# Altium schematic sheet module.SchDoc: NVM connections
size A3; Organization: GPA Robotics; DocumentNumber: 3; Revision: REV 0; SheetNumber: 3; SheetTotal: 11
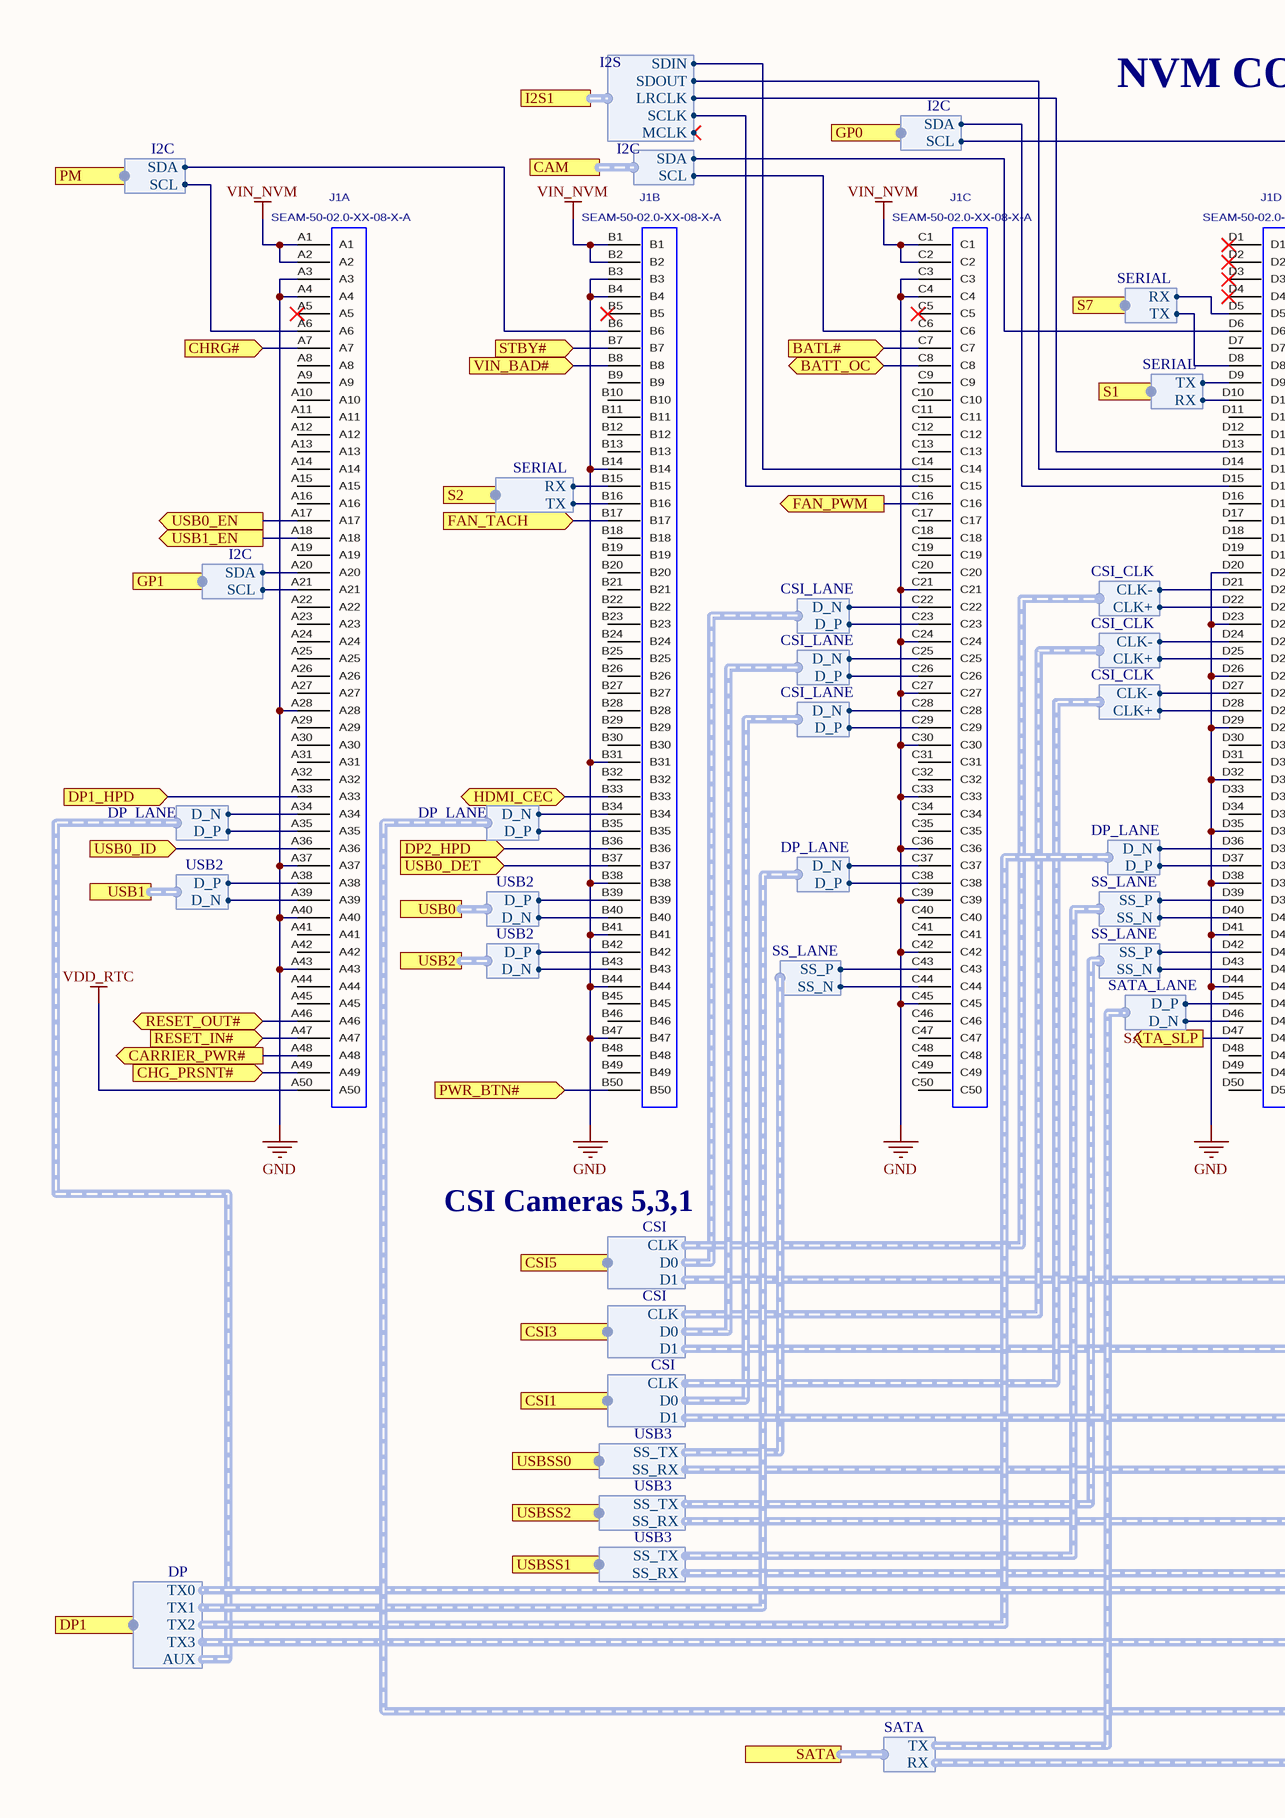
[diagram p0: module.SchDoc, left]
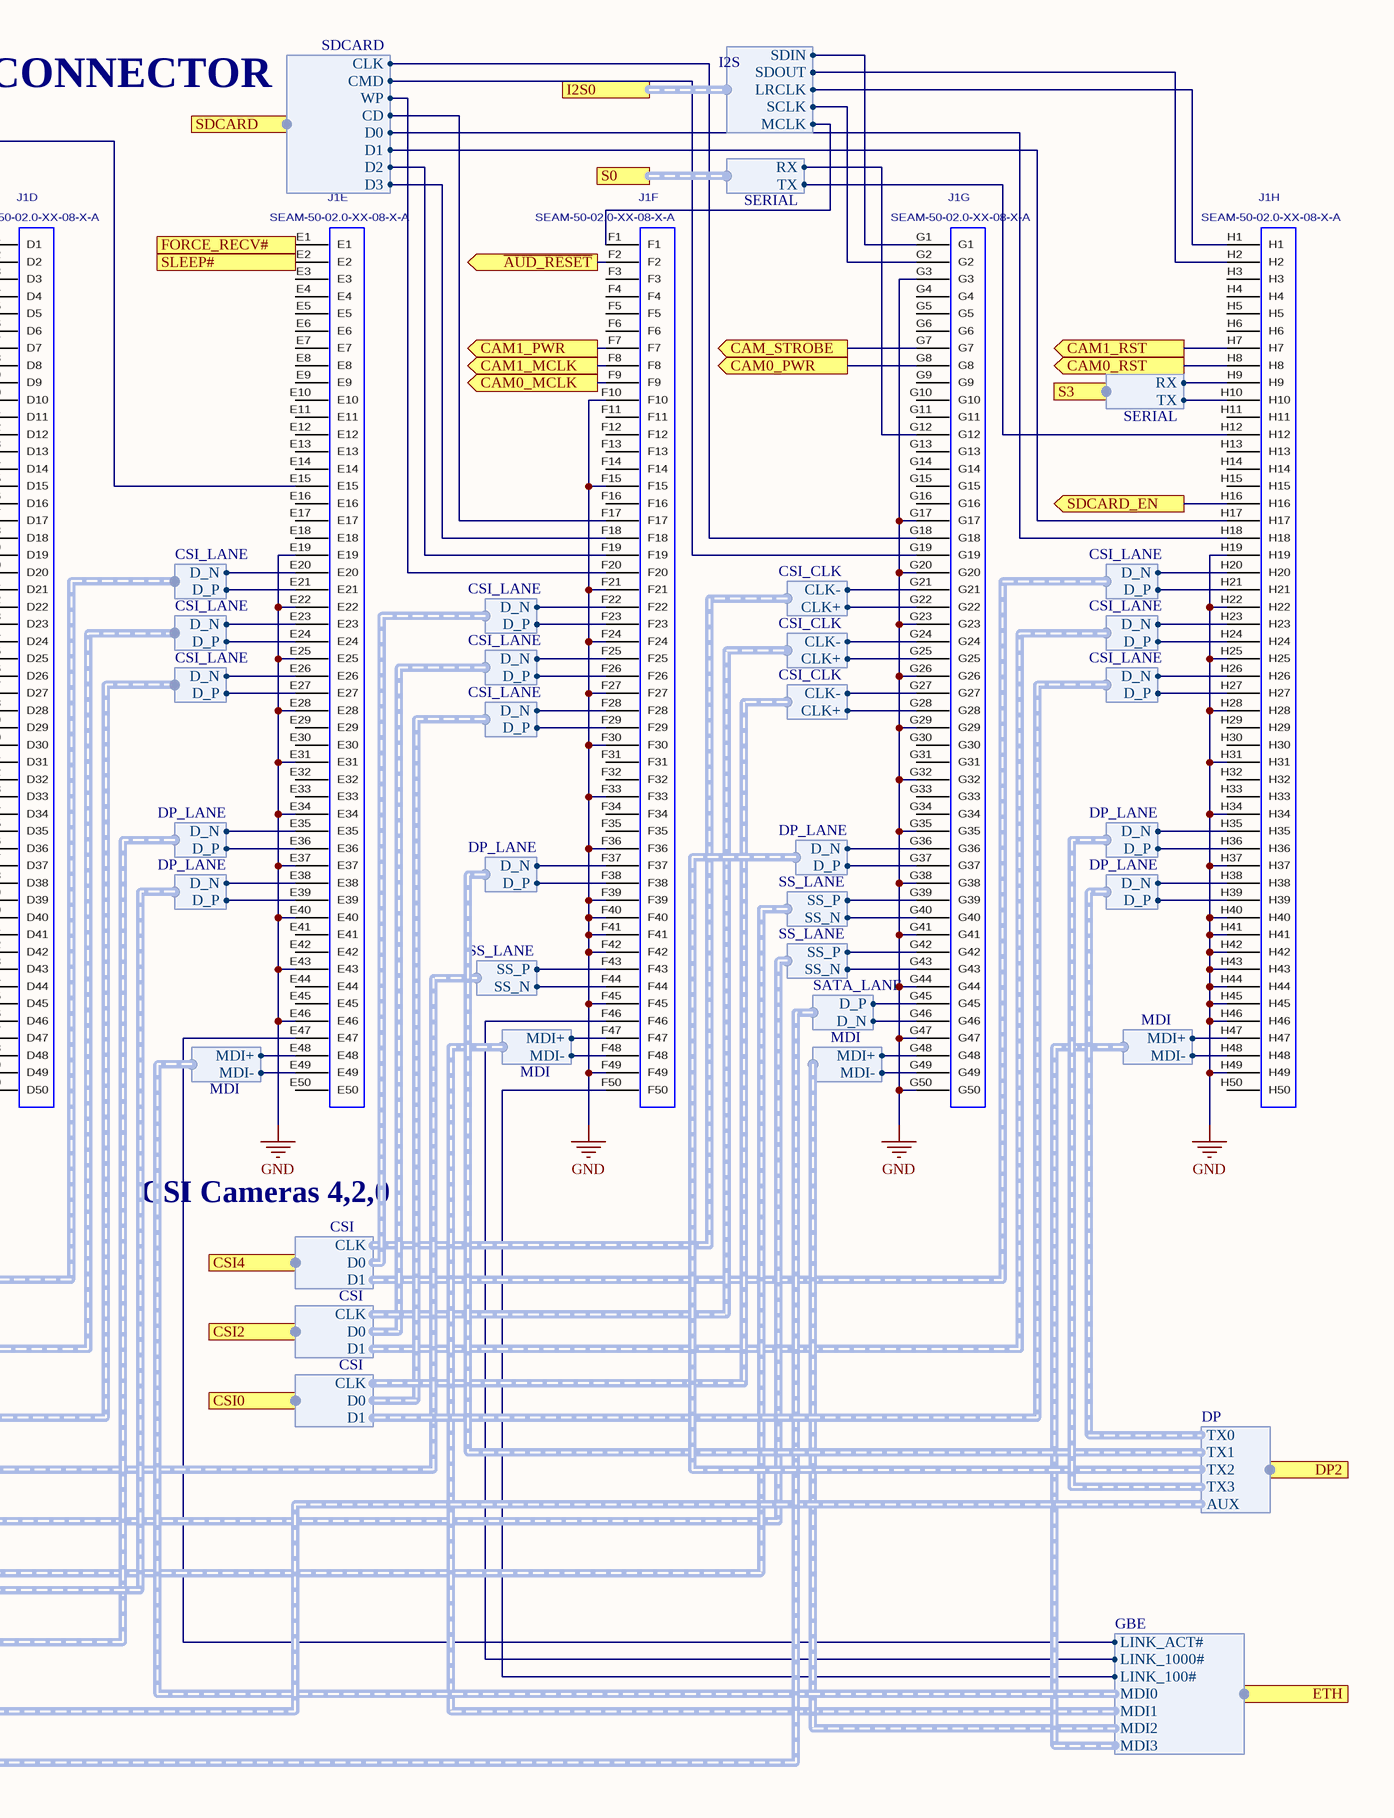
[diagram p1: module.SchDoc, right]

## Parts
J1  SEAM-50-02.0-XX-08-X-A  [SEAM-50-02.0-XX-08-X-A]  (parts A,B,C,D,E,F,G,H of 8)

## Ports
BATL# (in), BATT_OC (bidir), CAM0_MCLK (out), CAM0_PWR (out), CAM0_RST (out), CAM1_MCLK (out), CAM1_PWR (out), CAM1_RST (out), CAM (harness I2C), CAM_STROBE (out), CARRIER_PWR# (out), CHG_PRSNT# (in), CHRG# (in), CSI0 (harness CSI), CSI1 (harness CSI), CSI2 (harness CSI), CSI3 (harness CSI), CSI4 (harness CSI), CSI5 (harness CSI), DP1 (harness DP), DP1_HPD (in), DP2 (harness DP), DP2_HPD (in), ETH (harness GBE), FAN_PWM (out), FAN_TACH (in), FORCE_RECV# (in), GP0 (harness I2C), GP1 (harness I2C), HDMI_CEC (bidir), I2S0 (harness I2S), I2S1 (harness I2S), PM (harness I2C), PWR_BTN# (in), RESET_IN# (in), RESET_OUT# (bidir), S0 (harness SERIAL), S1 (harness SERIAL), S2 (harness SERIAL), S3 (harness SERIAL), S7 (harness SERIAL), SATA (harness SATA), SATA_SLP (out), SDCARD (harness SDCARD), SDCARD_EN (out), SLEEP# (in), STBY# (in), USB0 (harness USB2), USB0_DET (in), USB0_EN (out), USB0_ID (in), USB1 (harness USB2), USB1_EN (out), USB2 (harness USB2), USBSS0 (harness USB3), USBSS1 (harness USB3), USBSS2 (harness USB3), VIN_BAD# (in), ~{AUD_RESET} (out)

## Harnesses
CSI_CLK: CLK+, CLK-
CSI_LANE: D_P, D_N
CSI: D0, CLK, D1
USB3: SS_RX, SS_TX
USB2: D_P, D_N
I2C: SDA, SCL
SS_LANE: SS_P, SS_N
GBE: LINK_ACT#, LINK_1000#, LINK_100#, MDI0, MDI1, MDI2, MDI3
MDI: MDI+, MDI-
SDCARD: CLK, CMD, WP, CD, D0, D1, D2, D3
SERIAL: RX, TX
DP: TX1, TX0, TX2, TX3, AUX
DP_LANE: D_P, D_N
SATA: TX, RX
SATA_LANE: D_P, D_N
I2S: SDIN, SDOUT, LRCLK, SCLK, MCLK

## Nets
GND: J1.A3 J1.A4 J1.A28 J1.A37 J1.A40 J1.A43 J1.B3 J1.B4 J1.B14 J1.B31 J1.B38 J1.B41 J1.B44 J1.B47 J1.C3 J1.C4 J1.C21 J1.C24 J1.C27 J1.C30 J1.C33 J1.C36 J1.C39 J1.C42 J1.C45 J1.D20 J1.D23 J1.D26 J1.D29 J1.D32 J1.D35 J1.D38 J1.D41 J1.D44 J1.E19 J1.E22 J1.E25 J1.E28 J1.E31 J1.E34 J1.E37 J1.E40 J1.E43 J1.E46 J1.F10 J1.F15 J1.F21 J1.F24 J1.F27 J1.F30 J1.F33 J1.F36 J1.F39 J1.F40 J1.F41 J1.F42 J1.F45 J1.F49 J1.G3 J1.G17 J1.G20 J1.G23 J1.G26 J1.G29 J1.G32 J1.G35 J1.G38 J1.G41 J1.G44 J1.G47 J1.G50 J1.H19 J1.H22 J1.H25 J1.H28 J1.H31 J1.H34 J1.H37 J1.H40 J1.H41 J1.H42 J1.H43 J1.H44 J1.H45 J1.H46 J1.H49
VDD_RTC: J1.A50
VIN_NVM: J1.A1 J1.A2 J1.B1 J1.B2 J1.C1 J1.C2
~{AUD_RESET}: J1.F2 ; port ~{AUD_RESET}
BATL#: J1.C7 ; port BATL#
BATT_OC: J1.C8 ; port BATT_OC
CAM0_MCLK: J1.F9 ; port CAM0_MCLK
CAM0_PWR: J1.G8 ; port CAM0_PWR
CAM0_RST: J1.H8 ; port CAM0_RST
CAM1_MCLK: J1.F8 ; port CAM1_MCLK
CAM1_PWR: J1.F7 ; port CAM1_PWR
CAM1_RST: J1.H7 ; port CAM1_RST
CAM_STROBE: J1.G7 ; port CAM_STROBE
CARRIER_PWR#: J1.A48 ; port CARRIER_PWR#
CHG_PRSNT#: J1.A49 ; port CHG_PRSNT#
CHRG#: J1.A7 ; port CHRG#
DP1_HPD: J1.A33 ; port DP1_HPD
DP2_HPD: J1.B36 ; port DP2_HPD
FAN_PWM: J1.C16 ; port FAN_PWM
FAN_TACH: J1.B17 ; port FAN_TACH
FORCE_RECV#: J1.E1 ; port FORCE_RECV#
HDMI_CEC: J1.B33 ; port HDMI_CEC
PWR_BTN#: J1.B50 ; port PWR_BTN#
RESET_IN#: J1.A47 ; port RESET_IN#
RESET_OUT#: J1.A46 ; port RESET_OUT#
SATA_SLP: J1.D47 ; port SATA_SLP
SDCARD_EN: J1.H16 ; port SDCARD_EN
SLEEP#: J1.E2 ; port SLEEP#
STBY#: J1.B7 ; port STBY#
USB0_DET: J1.B37 ; port USB0_DET
USB0_EN: J1.A17 ; port USB0_EN
USB0_ID: J1.A36 ; port USB0_ID
USB1_EN: J1.A18 ; port USB1_EN
VIN_BAD#: J1.B8 ; port VIN_BAD#
NetJ1_A6: J1.A6 ; port PM.SCL
NetJ1_A20: J1.A20 ; port GP1.SDA
NetJ1_A21: J1.A21 ; port GP1.SCL
NetJ1_A34: J1.A34 ; harness DP_LANE.D_N
NetJ1_A35: J1.A35 ; harness DP_LANE.D_P
NetJ1_A38: J1.A38 ; port USB1.D_P
NetJ1_A39: J1.A39 ; port USB1.D_N
NetJ1_B6: J1.B6 ; port PM.SDA
NetJ1_B15: J1.B15 ; port S2.RX
NetJ1_B16: J1.B16 ; port S2.TX
NetJ1_B34: J1.B34 ; harness DP_LANE.D_N
NetJ1_B35: J1.B35 ; harness DP_LANE.D_P
NetJ1_B39: J1.B39 ; port USB0.D_P
NetJ1_B40: J1.B40 ; port USB0.D_N
NetJ1_B42: J1.B42 ; port USB2.D_P
NetJ1_B43: J1.B43 ; port USB2.D_N
NetJ1_C6: J1.C6 ; port CAM.SCL
NetJ1_C14: J1.C14 ; port I2S1.SDIN
NetJ1_C15: J1.C15 ; port I2S1.SCLK
NetJ1_C22: J1.C22 ; harness CSI_LANE.D_N
NetJ1_C23: J1.C23 ; harness CSI_LANE.D_P
NetJ1_C25: J1.C25 ; harness CSI_LANE.D_N
NetJ1_C26: J1.C26 ; harness CSI_LANE.D_P
NetJ1_C28: J1.C28 ; harness CSI_LANE.D_N
NetJ1_C29: J1.C29 ; harness CSI_LANE.D_P
NetJ1_C37: J1.C37 ; harness DP_LANE.D_N
NetJ1_C38: J1.C38 ; harness DP_LANE.D_P
NetJ1_C43: J1.C43 ; harness SS_LANE.SS_P
NetJ1_C44: J1.C44 ; harness SS_LANE.SS_N
NetJ1_D5: J1.D5 ; port S7.RX
NetJ1_D6: J1.D6 ; port CAM.SDA
NetJ1_D8: J1.D8 ; port S7.TX
NetJ1_D9: J1.D9 ; port S1.TX
NetJ1_D10: J1.D10 ; port S1.RX
NetJ1_D13: J1.D13 ; port I2S1.LRCLK
NetJ1_D14: J1.D14 ; port I2S1.SDOUT
NetJ1_D15: J1.D15 ; port GP0.SDA
NetJ1_D21: J1.D21 ; harness CSI_CLK.CLK-
NetJ1_D22: J1.D22 ; harness CSI_CLK.CLK+
NetJ1_D24: J1.D24 ; harness CSI_CLK.CLK-
NetJ1_D25: J1.D25 ; harness CSI_CLK.CLK+
NetJ1_D27: J1.D27 ; harness CSI_CLK.CLK-
NetJ1_D28: J1.D28 ; harness CSI_CLK.CLK+
NetJ1_D36: J1.D36 ; harness DP_LANE.D_N
NetJ1_D37: J1.D37 ; harness DP_LANE.D_P
NetJ1_D39: J1.D39 ; harness SS_LANE.SS_P
NetJ1_D40: J1.D40 ; harness SS_LANE.SS_N
NetJ1_D42: J1.D42 ; harness SS_LANE.SS_P
NetJ1_D43: J1.D43 ; harness SS_LANE.SS_N
NetJ1_D45: J1.D45 ; harness SATA_LANE.D_P
NetJ1_D46: J1.D46 ; harness SATA_LANE.D_N
NetJ1_E15: J1.E15 ; port GP0.SCL
NetJ1_E20: J1.E20 ; harness CSI_LANE.D_N
NetJ1_E21: J1.E21 ; harness CSI_LANE.D_P
NetJ1_E23: J1.E23 ; harness CSI_LANE.D_N
NetJ1_E24: J1.E24 ; harness CSI_LANE.D_P
NetJ1_E26: J1.E26 ; harness CSI_LANE.D_N
NetJ1_E27: J1.E27 ; harness CSI_LANE.D_P
NetJ1_E35: J1.E35 ; harness DP_LANE.D_N
NetJ1_E36: J1.E36 ; harness DP_LANE.D_P
NetJ1_E38: J1.E38 ; harness DP_LANE.D_N
NetJ1_E39: J1.E39 ; harness DP_LANE.D_P
NetJ1_E47: J1.E47 ; port ETH.LINK_ACT#
NetJ1_E48: J1.E48 ; harness MDI.MDI+
NetJ1_E49: J1.E49 ; harness MDI.MDI-
NetJ1_F1: J1.F1 ; port I2S0.MCLK
NetJ1_F17: J1.F17 ; port SDCARD.CD
NetJ1_F18: J1.F18 ; port SDCARD.D3
NetJ1_F19: J1.F19 ; port SDCARD.D2
NetJ1_F20: J1.F20 ; port SDCARD.WP
NetJ1_F22: J1.F22 ; harness CSI_LANE.D_N
NetJ1_F23: J1.F23 ; harness CSI_LANE.D_P
NetJ1_F25: J1.F25 ; harness CSI_LANE.D_N
NetJ1_F26: J1.F26 ; harness CSI_LANE.D_P
NetJ1_F28: J1.F28 ; harness CSI_LANE.D_N
NetJ1_F29: J1.F29 ; harness CSI_LANE.D_P
NetJ1_F37: J1.F37 ; harness DP_LANE.D_N
NetJ1_F38: J1.F38 ; harness DP_LANE.D_P
NetJ1_F43: J1.F43 ; harness SS_LANE.SS_P
NetJ1_F44: J1.F44 ; harness SS_LANE.SS_N
NetJ1_F46: J1.F46 ; port ETH.LINK_1000#
NetJ1_F47: J1.F47 ; harness MDI.MDI+
NetJ1_F48: J1.F48 ; harness MDI.MDI-
NetJ1_F50: J1.F50 ; port ETH.LINK_100#
NetJ1_G1: J1.G1 ; port I2S0.SDIN
NetJ1_G2: J1.G2 ; port I2S0.SCLK
NetJ1_G12: J1.G12 ; port S0.RX
NetJ1_G18: J1.G18 ; port SDCARD.CLK
NetJ1_G19: J1.G19 ; port SDCARD.CMD
NetJ1_G21: J1.G21 ; harness CSI_CLK.CLK-
NetJ1_G22: J1.G22 ; harness CSI_CLK.CLK+
NetJ1_G24: J1.G24 ; harness CSI_CLK.CLK-
NetJ1_G25: J1.G25 ; harness CSI_CLK.CLK+
NetJ1_G27: J1.G27 ; harness CSI_CLK.CLK-
NetJ1_G28: J1.G28 ; harness CSI_CLK.CLK+
NetJ1_G36: J1.G36 ; harness DP_LANE.D_N
NetJ1_G37: J1.G37 ; harness DP_LANE.D_P
NetJ1_G39: J1.G39 ; harness SS_LANE.SS_P
NetJ1_G40: J1.G40 ; harness SS_LANE.SS_N
NetJ1_G42: J1.G42 ; harness SS_LANE.SS_P
NetJ1_G43: J1.G43 ; harness SS_LANE.SS_N
NetJ1_G45: J1.G45 ; harness SATA_LANE.D_P
NetJ1_G46: J1.G46 ; harness SATA_LANE.D_N
NetJ1_G48: J1.G48 ; harness MDI.MDI+
NetJ1_G49: J1.G49 ; harness MDI.MDI-
NetJ1_H1: J1.H1 ; port I2S0.LRCLK
NetJ1_H2: J1.H2 ; port I2S0.SDOUT
NetJ1_H9: J1.H9 ; port S3.RX
NetJ1_H10: J1.H10 ; port S3.TX
NetJ1_H12: J1.H12 ; port S0.TX
NetJ1_H17: J1.H17 ; port SDCARD.D1
NetJ1_H18: J1.H18 ; port SDCARD.D0
NetJ1_H20: J1.H20 ; harness CSI_LANE.D_N
NetJ1_H21: J1.H21 ; harness CSI_LANE.D_P
NetJ1_H23: J1.H23 ; harness CSI_LANE.D_N
NetJ1_H24: J1.H24 ; harness CSI_LANE.D_P
NetJ1_H26: J1.H26 ; harness CSI_LANE.D_N
NetJ1_H27: J1.H27 ; harness CSI_LANE.D_P
NetJ1_H35: J1.H35 ; harness DP_LANE.D_N
NetJ1_H36: J1.H36 ; harness DP_LANE.D_P
NetJ1_H38: J1.H38 ; harness DP_LANE.D_N
NetJ1_H39: J1.H39 ; harness DP_LANE.D_P
NetJ1_H47: J1.H47 ; harness MDI.MDI+
NetJ1_H48: J1.H48 ; harness MDI.MDI-

Not connected (* = marked no-connect by the designer): J1 A5* A8 A9 A10 A11 A12 A13 A14 A15 A16 A19 A22 A23 A24 A25 A26 A27 A29 A30 A31 A32 A41 A42 A44 A45 B5* B9 B10 B11 B12 B13 B18 B19 B20 B21 B22 B23 B24 B25 B26 B27 B28 B29 B30 B32 B45 B46 B48 B49 C5* C9 C10 C11 C12 C13 C17 C18 C19 C20 C31 C32 C34 C35 C40 C41 C46 C47 C48 C49 C50 D1* D2* D3* D4* D7 D11 D12 D16 D17 D18 D19 D30 D31 D33 D34 D48 D49 D50 E3 E4 E5 E6 E7 E8 E9 E10 E11 E12 E13 E14 E16 E17 E18 E29 E30 E32 E33 E41 E42 E44 E45 E50 F3 F4 F5 F6 F11 F12 F13 F14 F16 F31 F32 F34 F35 G4 G5 G6 G9 G10 G11 G13 G14 G15 G16 G30 G31 G33 G34 H3 H4 H5 H6 H11 H13 H14 H15 H29 H30 H32 H33 H50

## Notes on the sheet
- NVM CONNECTOR
- CSI Cameras 5,3,1
- CSI Cameras 4,2,0
- Title
- Size:
- Date:
- A3
- Number:
- Time:
- Revision:
- Sheet
- of
- Repo:

## Library data of the parts
J1 = SEAM-50-02.0-XX-08-X-A: 0.050" TERMINAL ASSEMBLY.; MANUFACTURER: SAMTEC; CREATED: December 10, 2015 -Wendy Xin; PCB DECAL: SEAM-50-02.0-XX-08-X-A